# EAGLE design substractor-741_p-stm-v1.0 (EAGLE 6.5.0)
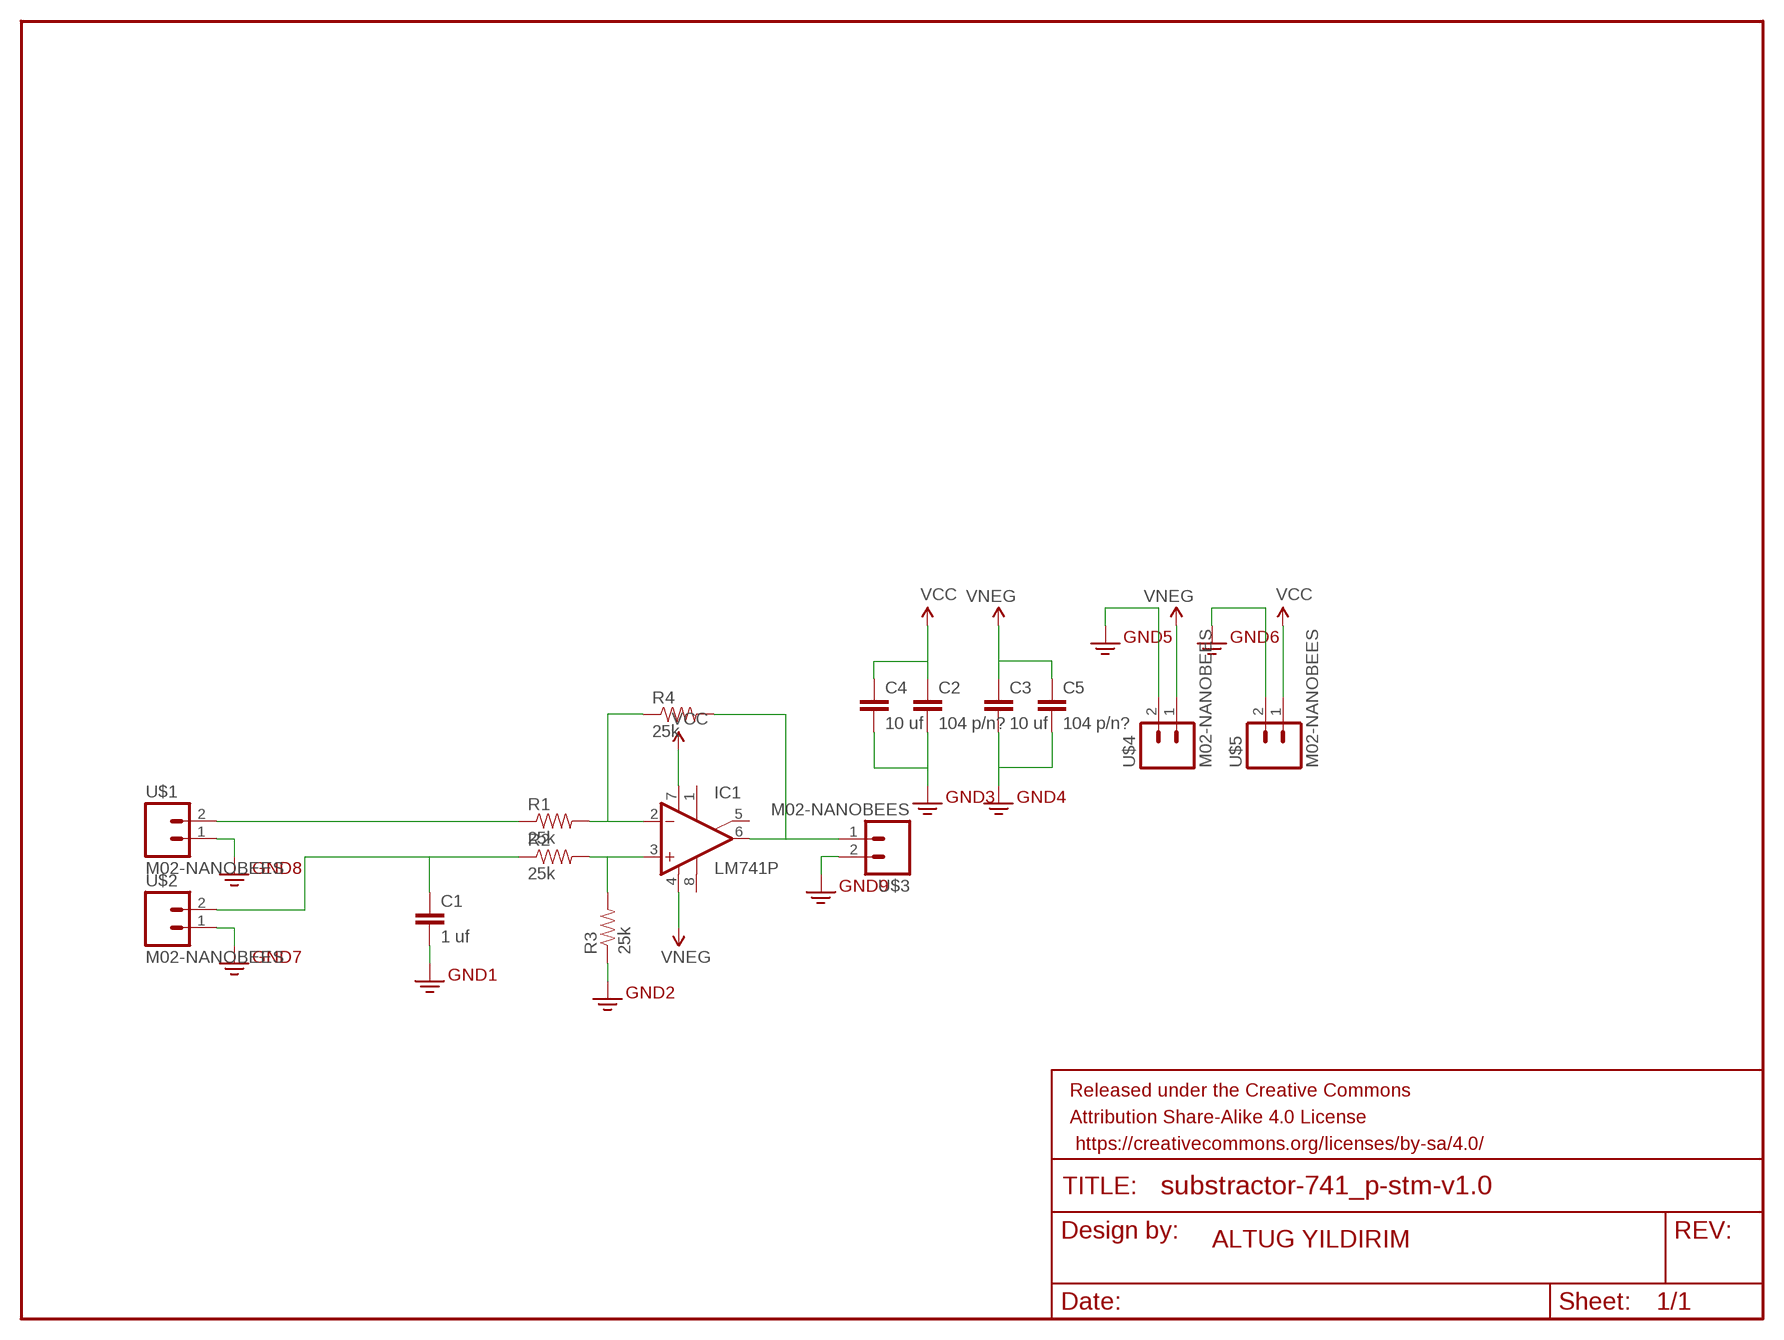
[diagram p0: schematic, sheet 1]

## Parts
C1  1 uf  CAPPTH2  [CAP-PTH-SMALL2]
C2  104 p/n?  CAPPTH2  [CAP-PTH-SMALL2]
C3  10 uf  CAPPTH2  [CAP-PTH-SMALL2]
C4  10 uf  CAPPTH2  [CAP-PTH-SMALL2]
C5  104 p/n?  CAPPTH2  [CAP-PTH-SMALL2]
FRAME1  FRAME-LETTER  [CREATIVE_COMMONS]
IC1  LM741P  [DIL08]
R1  25k  RESISTORPTH-1/4W  [AXIAL-0.4]
R2  25k  RESISTORPTH-1/4W  [AXIAL-0.4]
R3  25k  RESISTORPTH-1/4W  [AXIAL-0.4]
R4  25k  RESISTORPTH-1/4W  [AXIAL-0.4]
U$1  M02-NANOBEES  [M02-NANOBEES]
U$2  M02-NANOBEES  [M02-NANOBEES]
U$3  M02-NANOBEES  [M02-NANOBEES]
U$4  M02-NANOBEES  [M02-NANOBEES]
U$5  M02-NANOBEES  [M02-NANOBEES]

## Nets
GND: C1.2 C2.2 C3.2 C4.2 C5.2 R3.P$1 U$1.1 U$2.1 U$3.2 U$4.2 U$5.2 ; supply symbol labelled GND2
N$1: R1.P$1 U$1.2
N$2: C1.1 R2.P$1 U$2.2
N$3: IC1.2(+IN) R1.P$2 R4.P$1
N$4: IC1.3(-IN) R2.P$2 R3.P$2
N$5: IC1.6(OUT) R4.P$2 U$3.1
VCC: C2.1 C4.1 IC1.7(V+) U$5.1
VNEG: C3.1 C5.1 IC1.4(V-) U$4.1
Unconnected: IC1.1(ON1) IC1.5(ON2) IC1.8(OPT)

## Notes on the sheet
- ALTUG YILDIRIM

## Library data of the parts
C1-C5 = SparkFun-Capacitors:CAP: Capacitor Standard 0603 ceramic capacitor, and 0.1" leaded capacitor.
FRAME1 = SparkFun-Aesthetics:FRAME-LETTER: Schematic Frame Standard 8.5x11 US Letter frame
IC1 = linear:*741: OP AMP
R1-R4 = SparkFun-Resistors:RESISTOR: Resistor Basic schematic elements and footprints for 0603, 1206, and PTH resistors.
U$1-U$5 = SparkFun-Connectors:M02-NANOBEES

## Board
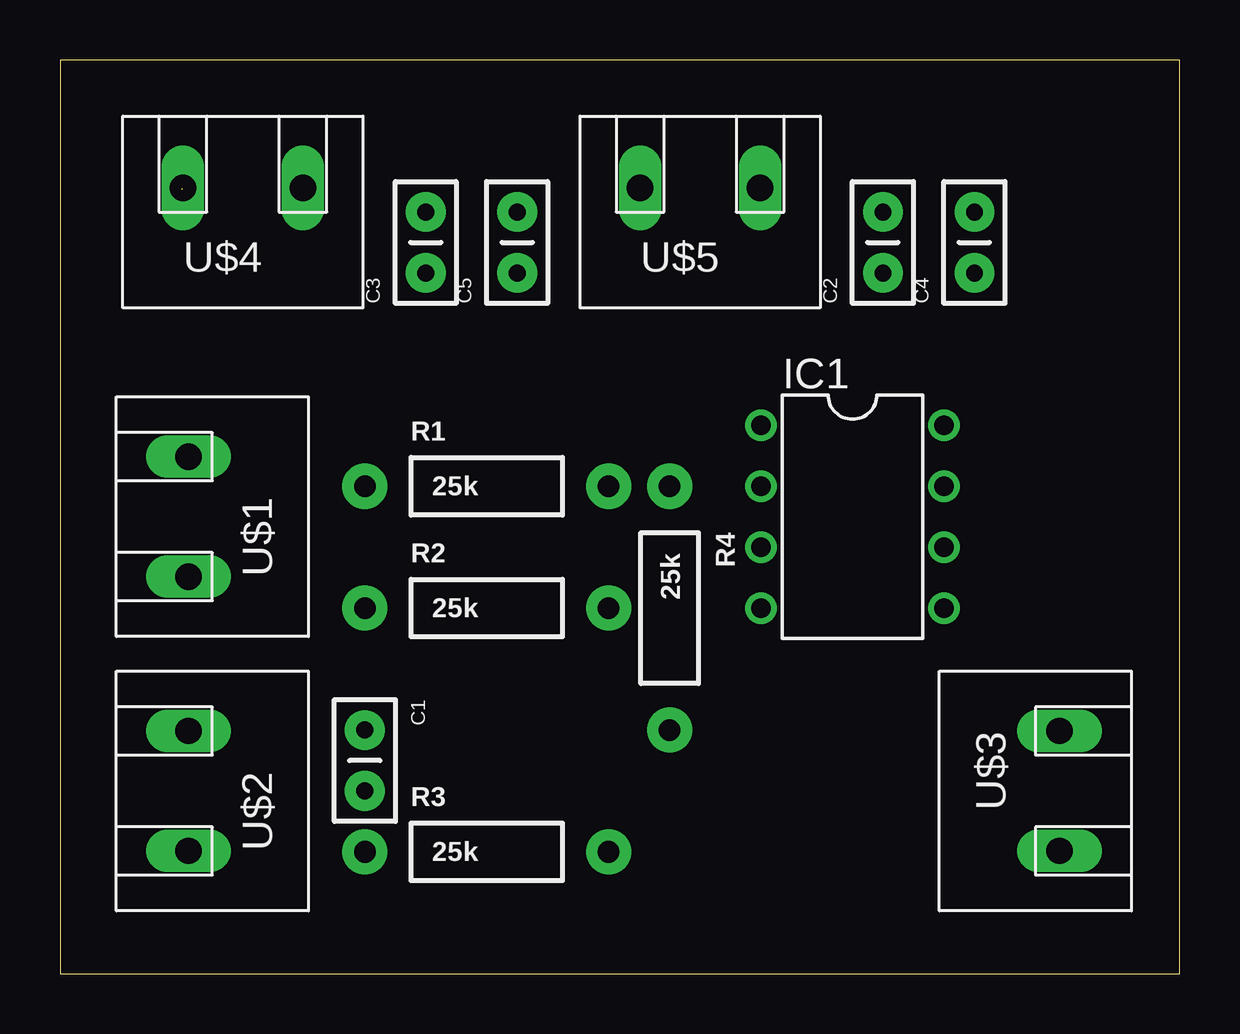
[diagram p1: board, top side]
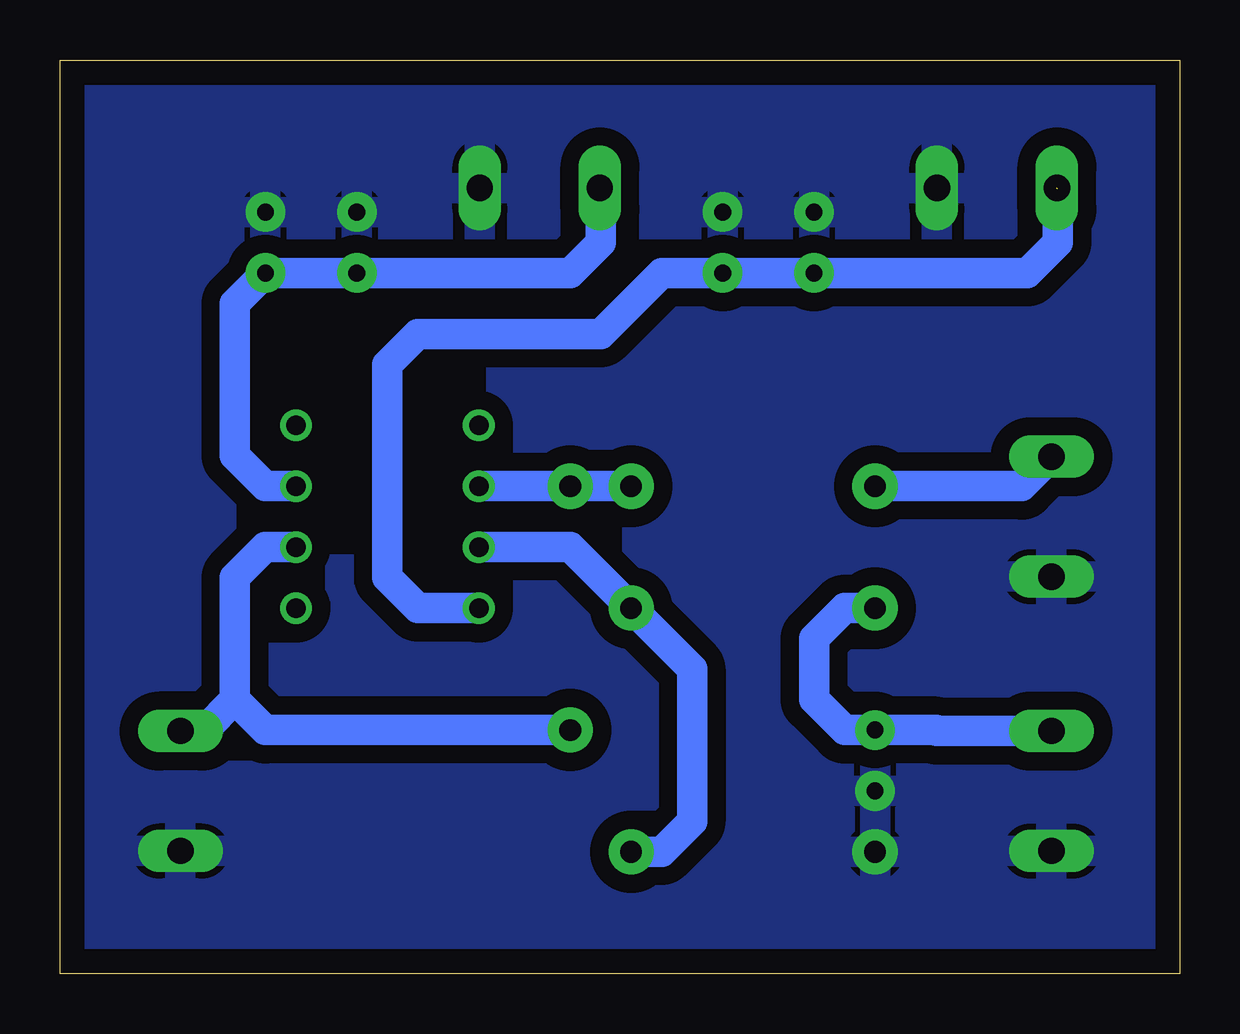
[diagram p2: board, bottom side, seen from below]

Size 46.66 x 38.09 mm. Coordinates in mm from the lower left corner, seen from the top.
Outline: 0,0 46.66,0 46.66,38.09 0,38.09 0,0
Copper layers (1*16): Top 0.035mm / dielectric 1.5mm / Bottom 0.035mm
Design rules "default": minimum track width 10mil, minimum drill 24mil, track to track 8mil, track to pad 8mil, pad to pad 8mil, via to via 8mil, smd to smd 8mil, copper to edge 40mil, drill to drill 8mil, minimum pad ring 10mil, minimum via ring 8mil, stop-mask expansion 4mil, vias tented up to drill 0mil, thermal gap 10mil

### Footprints (pad centres in the part's own frame; a part is rotated, then mirrored left to right if it is on the bottom)
CAP-PTH-SMALL2 = drill 0.7 pad 1.651: 1 0,0; 2 2.54,0
DIL08 = drill 0.813 pad 1.27: 1 -3.81,-3.81; 2 -1.27,-3.81; 3 1.27,-3.81; 4 3.81,-3.81; 5 3.81,3.81; 6 1.27,3.81; 7 -1.27,3.81; 8 -3.81,3.81
AXIAL-0.4 = drill 0.9 pad 1.88: P$1 -5.08,0; P$2 5.08,0
M02-NANOBEES = drill 1.1 pad 1.778 long: 1 -2.5,1; 2 2.5,1

### Placement (x,y rotation side)
C1  12.7,10.16 270 top
C2  34.29,29.21 90 top
C3  15.24,29.21 90 top
C4  38.1,29.21 90 top
C5  19.05,29.21 90 top
FRAME1  1.27,-8.89 0 top  (outside the outline)
IC1  33.02,19.05 270 top
R1  17.78,20.32 0 top
R2  17.78,15.24 0 top
R3  17.78,5.08 0 top
R4  25.4,15.24 270 top
U$1  6.35,19.05 90 top
U$2  6.35,7.62 90 top
U$3  40.64,7.62 270 top
U$4  7.62,31.75 0 top
U$5  26.67,31.75 0 top

### Tracks (layer width: path | path; a pad name or v marks a point on that pad's centre or on a via)
GND
  pour Bottom (isolate 0.762): 0,38.1 0,0 46.99,0 46.99,38.1
N$1
  Bottom 1.27: U$1.2 6.58,20.32 R1.P$1
N$2
  Bottom 1.27: U$2.2 10.12,10.12 10.16,10.16 C1.1 13.97,10.16 15.24,11.43 15.24,13.97 13.97,15.24 R2.P$1
N$3
  Bottom 1.27: IC1.2 R4.P$1 R1.P$2
N$4
  Bottom 1.27: IC1.3 25.4,17.78 R2.P$2 20.32,12.7 20.32,6.35 21.59,5.08 R3.P$2
N$5
  Bottom 1.27: IC1.6 38.1,17.78 39.37,16.51 39.37,11.43 | 39.37,11.43 40.68,10.12 U$3.1 | R4.P$2 38.1,10.16 39.37,11.43
VCC
  Bottom 1.27: IC1.7 38.1,20.32 39.37,21.59 39.37,27.94 C4.1 C2.1 25.4,29.21 24.13,30.48 24.13,32.71 U$5.1
VNEG  (1 unrouted)
  Bottom 1.27: IC1.4 31.75,15.24 33.02,16.51 33.02,25.4 31.75,26.67 24.13,26.67 21.59,29.21 C5.1 C3.1 6.35,29.21 5.08,30.48 5.08,32.71